# Altium schematic sheet Sensors.SchDoc: Sensors
size A4; DrawnBy: Jarod Krane; Organization: Altium Limited; Address1: L3, 12a Rodborough Rd; Address2: Frenchs Forest; Address3: NSW; Address4: Australia 2086; Revision: 0; SheetNumber: 10; SheetTotal: 11
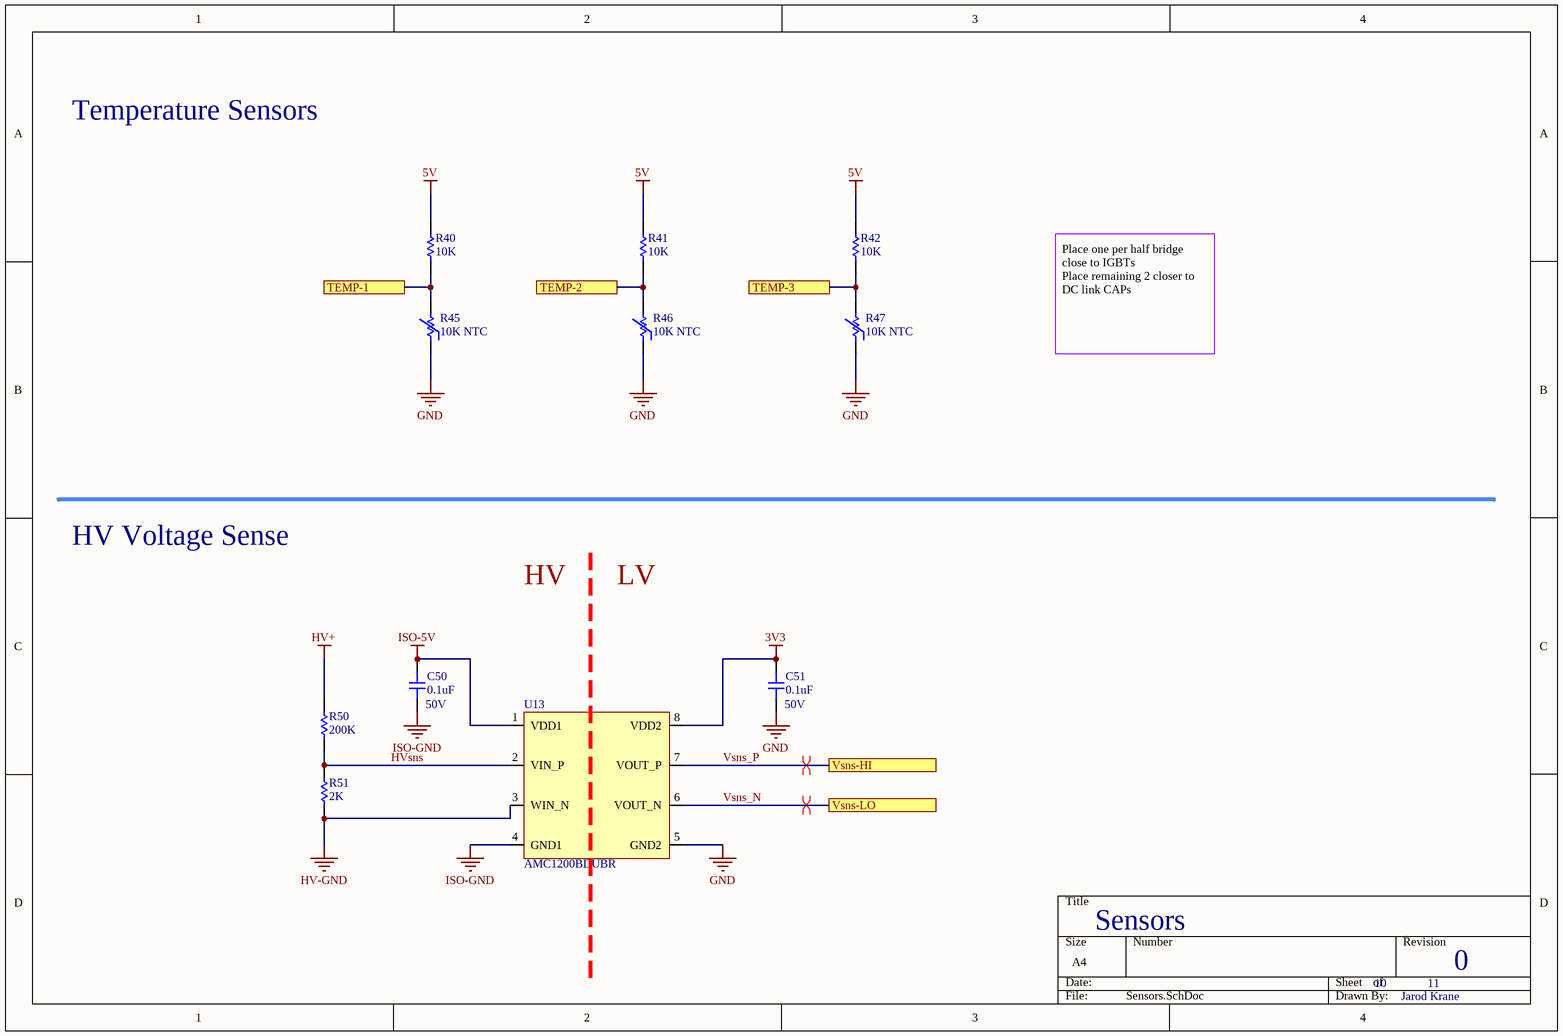
[diagram p0: Sensors.SchDoc]

## Parts
C50  0.1uF  Voltage Rating (DC): 50V  [CAP-0805]
C51  0.1uF  Voltage: 50V  [CAP-0805]
R40  10K  [RES-0603]
R41  10K  [RES-0603]
R42  10K  [RES-0603]
R45  10K NTC  [RES-0603]
R46  10K NTC  [RES-0603]
R47  10K NTC  [RES-0603]
R50  200K  [RES-0603]
R51  2K  [RES-0603]
U13  AMC1200BDUBR  [8-SOP]

## Ports
TEMP-1, TEMP-2, TEMP-3, Vsns-HI, Vsns-LO

## Nets
3V3: C51.2 U13.8(VDD2)
5V: R40.2 R41.2 R42.2
GND: C51.1 R45.1 R46.1 R47.1 U13.5(GND2)
HV+: R50.2
HV-GND: R51.1 U13.3(WIN_N)
ISO-5V: C50.2 U13.1(VDD1)
ISO-GND: C50.1 U13.4(GND1)
HVsns: R50.1 R51.2 U13.2(VIN_P)
TEMP-1: R40.1 R45.2 ; port TEMP-1
TEMP-2: R41.1 R46.2 ; port TEMP-2
TEMP-3: R42.1 R47.2 ; port TEMP-3
Vsns_N: U13.6(VOUT_N) ; port Vsns-LO
Vsns_P: U13.7(VOUT_P) ; port Vsns-HI

## Layout directives
differential pair: Vsns_N, Vsns_P

## Notes on the sheet
- Temperature Sensors
- Place one per half bridge close to IGBTs
  Place remaining 2 closer to DC link CAPs
- HV Voltage Sense
- HV
- LV
- Title
- Size:
- Date:
- A4
- Number:
- Time:
- Revision:
- Sheet
- of
- File:

## Library data of the parts
C50 C51 = 0805-0.1uF-50V: CAP CER 0.1UF 50V Y5V 0805; Manufacturer: KEMET; Manufacturer Part Number: C0805C104Z5VACTU; Dielectric Material: Ceramic; Capacitance: 100nF; Tolerance: 80%; Dissipation Factor: 5%; Supplier 1: Digi-Key; Stock 1: 929243; Pricing 1: 1=0.1, 10=0.057, 100=0.0254, 500=0.01818, 1000=0.01428 (USD); Mount: Surface Mount,PCB; Case/Package: 0805; Number of Pins: 2; Case Code (Metric): 2012; Case Code (Imperial): 0805; Min Operating Temperature: -30°C; Max Operating Temperature: 85°C; Package Quantity: 1; Voltage Rating: 50V; Packaging: Tape and Reel; Dielectric: Y5V; Termination: SMD/SMT; Length: 2mm; Height: 0.9mm; Lead Pitch: 0.75mm; Width: 0.049inch; Thickness: 0.039inch; Depth: 1.25mm; Radiation Hardening: No; REACH SVHC: No SVHC; Lead Free: Lead Free; ComponentLink1URL: http://www.alliedelec.com/m/d/9bfe7773041ffe9d406e68bc7b377fdd.pdf?src-supplier=Allied+Electronics; ComponentLink1Description: http://www.alliedelec.com/m/d/9bfe7773041ffe9d406e68bc7b377fdd.pdf?src-supplier=Allied+Electronics; ComponentLink2URL: https://www.verical.com/server-webapp/html/getDatasheet?partID=37101&src-supplier=Verical; ComponentLink2Description: https://www.verical.com/server-webapp/html/getDatasheet?partID=37101&src-supplier=Verical; ComponentLink3URL: https://www.verical.com/server-webapp/html/getDatasheet?partID=321176&src-supplier=Verical; ComponentLink3Description: https://www.verical.com/server-webapp/html/getDatasheet?partID=321176&src-supplier=Verical; ComponentLink4URL: http://www.farnell.com/datasheets/2123124.pdf?src-supplier=Element14; ComponentLink4Description: http://www.farnell.com/datasheets/2123124.pdf?src-supplier=Element14; Supplier Part Number 1: 399-1177-6-ND
  C50: Voltage: 50V
  C51: Voltage Rating (DC): 50V
R40-R42 = 0603-10KR: RES SMD 10K OHM 5% 1/10W 0603; Manufacturer: Yageo; Manufacturer Part Number: RC0603JR-0710KL; Resistance: 10kR; Voltage Rating (DC): 50V; Temperature Coefficient: 100ppm/°C; Power Rating: 100mW; Supplier 1: Digi-Key; Stock 1: 3006558; Pricing 1: 1=0.1, 10=0.019, 100=0.0077, 1000=0.00347, 2500=0.00301 (USD); Case/Package: 0603; Number of Pins: 2; Contact Plating: Tin,Matte; Case Code (Imperial): 0603; Case Code (Metric): 1608; Min Operating Temperature: -55°C; Max Operating Temperature: 155°C; Packaging: Tape and Reel; Tolerance: 5%; Composition: Thick Film; Voltage Rating: 50V; Termination: SMD/SMT; Military Standard: Not; Features: Moisture Resistant; Max Power Dissipation: 100mW; Number of Terminations: 2; Length: 0.063inch; Width: 0.031inch; Depth: 0.8mm; Height - Seated (Max): 0.022inch; Radiation Hardening: No; REACH SVHC: Unknown; Lead Free: Lead Free; ComponentLink1URL: http://www.yageo.com/documents/recent/PYu-RC_Group_51_RoHS_L_10.pdf?src-supplier=Digi-Key; ComponentLink1Description: http://www.yageo.com/documents/recent/PYu-RC_Group_51_RoHS_L_10.pdf?src-supplier=Digi-Key; Supplier Part Number 1: 311-10KGRDKR-ND
R45-R47 = 0603-10K-thermistor: THERMISTOR NTC 10KOHM 3380K 0603; Manufacturer: Murata; Manufacturer Part Number: NCP18XH103F03RB; Resistance: 10kR; Tolerance: 1%; Power Rating: 100mW; Current Rating: 310uA; Accuracy: 0.7%; Supplier 1: Digi-Key; Stock 1: 66922; Pricing 1: 1=0.24, 5=0.23, 10=0.204, 25=0.1876, 50=0.15, 100=0.1286, 500=0.1125, 1000=0.09643 (USD); Mount: Surface Mount; Case/Package: 0603; Number of Pins: 2; Case Code (Metric): 1608; Case Code (Imperial): 0603; Number of Terminals: 2; Min Operating Temperature: -40°C; Max Operating Temperature: 125°C; Packaging: Tape and Reel; Package Quantity: 1; Termination: SMD/SMT; Max Power Dissipation: 100mW; Length: 1.6mm; Height: 0.8mm; Depth: 0.8mm; Radiation Hardening: No; REACH SVHC: No SVHC; Lead Free: Lead Free; ComponentLink1URL: http://www.mouser.com/ds/2/281/r44e-522712.pdf?src-supplier=Mouser; ComponentLink1Description: http://www.mouser.com/ds/2/281/r44e-522712.pdf?src-supplier=Mouser; ComponentLink2URL: http://uk.rs-online.com/webdocs/07f1/0900766b807f1e39.pdf?src-supplier=RSComponents; ComponentLink2Description: http://uk.rs-online.com/webdocs/07f1/0900766b807f1e39.pdf?src-supplier=RSComponents; ComponentLink3URL: http://www.murata.com/~/media/webrenewal/support/library/catalog/products/thermistor/ntc/r44e.ashx?src-supplier=Avnet; ComponentLink3Description: http://www.murata.com/~/media/webrenewal/support/library/catalog/products/thermistor/ntc/r44e.ashx?src-supplier=Avnet; ComponentLink4URL: https://www.verical.com/server-webapp/html/getDatasheet?partID=153236&src-supplier=Verical; ComponentLink4Description: https://www.verical.com/server-webapp/html/getDatasheet?partID=153236&src-supplier=Verical; ComponentLink5URL: https://www.murata.com/~/media/webrenewal/support/library/catalog/products/thermistor/ntc/r44e.ashx?la=en-us&src-supplier=Digi-Key; ComponentLink5Description: https://www.murata.com/~/media/webrenewal/support/library/catalog/products/thermistor/ntc/r44e.ashx?la=en-us&src-supplier=Digi-Key; ComponentLink6URL: http://search.murata.co.jp/Ceramy/image/img/w_hinm/L0770E.pdf?src-supplier=Future+Electronics; ComponentLink6Description: http://search.murata.co.jp/Ceramy/image/img/w_hinm/L0770E.pdf?src-supplier=Future+Electronics; ComponentLink7URL: http://search.murata.co.jp/Ceramy/image/img/w_hinm/L0770E.pdf?src-supplier=Avnet+Europe; ComponentLink7Description: http://search.murata.co.jp/Ceramy/image/img/w_hinm/L0770E.pdf?src-supplier=Avnet+Europe; Supplier Part Number 1: 490-4800-6-ND
R50 = 0603-200KR: RES SMD 200K OHM 1% 1/10W 0603; Manufacturer: Yageo; Manufacturer Part Number: AF0603FR-07200KL; Max Power Dissipation: 100mW; Temperature Coefficient: 100ppm/°C; Resistance: 200kR; Supplier 1: Digi-Key; Stock 1: 4721; Pricing 1: 1=0.1, 10=0.061, 100=0.0247, 1000=0.01109, 2500=0.00963 (USD); Case/Package: 0603; Min Operating Temperature: -55°C; Max Operating Temperature: 155°C; Packaging: Tape and Reel; Resistor Type: Thick Film; Number of Terminations: 2; Tolerance: 1%; Features: Moisture Resistant,Anti-Sulfur; Length: 0.063inch; Width: 0.031inch; Height: 0.022inch; RoHS Compliant: Yes; ComponentLink1URL: http://www.yageo.com/documents/recent/PYu-AF_51_RoHS_L_5.pdf?src-supplier=Digi-Key; ComponentLink1Description: http://www.yageo.com/documents/recent/PYu-AF_51_RoHS_L_5.pdf?src-supplier=Digi-Key; Supplier Part Number 1: 13-AF0603FR-07200KLDKR-ND
R51 = 0603-2KR: RES SMD 2K OHM 1% 1/4W 0603; Manufacturer: Vishay Dale; Manufacturer Part Number: CRCW06032K00FKEAHP; Resistance: 2kR; Power Rating: 250mW; Voltage Rating: 75V; Temperature Coefficient: 100ppm/°C; Supplier 1: Digi-Key; Stock 1: 23723; Pricing 1: 1=0.17, 10=0.142, 100=0.0553, 1000=0.02317, 2500=0.02124 (USD); Mount: Surface Mount; Case/Package: 0603; Weight: 7.1E-05oz; Case Code (Metric): 1608; Case Code (Imperial): 0603; Contact Plating: Tin; Min Operating Temperature: -55°C; Max Operating Temperature: 155°C; Package Quantity: 10; Tolerance: 1%; Packaging: Tape and Reel; Composition: Thick Film; Number of Terminations: 2; Termination: Solder; Max Power Dissipation: 250mW; Features: Automotive AEC-Q200; Military Standard: Not; Length: 1.6mm; Height: 0.45mm; Width: 0.033inch; Depth: 0.85mm; Radiation Hardening: No; Lead Free: Lead Free; ComponentLink1URL: http://www.vishay.com/docs/20043/crcwhpe3.pdf?src-supplier=Digi-Key; ComponentLink1Description: http://www.vishay.com/docs/20043/crcwhpe3.pdf?src-supplier=Digi-Key; Supplier Part Number 1: 541-2.00KSDKR-ND
U13 = ISO-OPAMP: IC OPAMP ISOLATION 1 CIRC 8SOP; Manufacturer: Texas Instruments; Number of Channels: 1; Common Mode Rejection Ratio: 95dB; Operating Supply Voltage: 5.5V; -3db Bandwidth: 100kHz; Nominal Supply Current: 5.4mA; Output Current: 20mA; Max Input Voltage: 320mV; Input Offset Voltage (Vos): 200uV; Power Dissipation: 44mW; Power Supply Rejection Ratio (PSRR): 61dB; Dual Supply Voltage: 5V; Power Consumption: 82.5mW; Supplier 1: Digi-Key; Manufacturer Part Number: AMC1200BDUBR; Stock 1: 0; Pricing 1: 1=4.92, 10=4.415, 25=4.1736, 100=3.6172 (USD); Mount: Surface Mount; Case/Package: SOP; Number of Pins: 8; Min Operating Temperature: -40°C; Max Operating Temperature: 105°C; Max Dual Supply Voltage: 5.5V; Packaging: Tape and Reel; Package Quantity: 350; Bandwidth: 100kHz; Number of Circuits: 1; Operating Supply Current: 5.4mA; Output Current per Channel: 20mA; Max Power Dissipation: 44mW; Number of Elements: 1; Series: -; Amplifier Type: ISOLATION; Supply Current: 5.4mA; Lead Free: Lead Free; RoHS Compliant: Yes; ComponentLink1URL: http://www.ti.com/general/docs/lit/getliterature.tsp?genericPartNumber=AMC1200&&fileType=pdf&src-supplier=Avnet; ComponentLink1Description: http://www.ti.com/general/docs/lit/getliterature.tsp?genericPartNumber=AMC1200&&fileType=pdf&src-supplier=Avnet; ComponentLink2URL: http://www.ti.com/lit/ds/symlink/amc1200.pdf?src-supplier=Digi-Key; ComponentLink2Description: http://www.ti.com/lit/ds/symlink/amc1200.pdf?src-supplier=Digi-Key; Supplier Part Number 1: 296-38868-6-ND